# Altium schematic sheet merci_proc.SchDoc
size A4; SheetNumber: 2; SheetTotal: 2
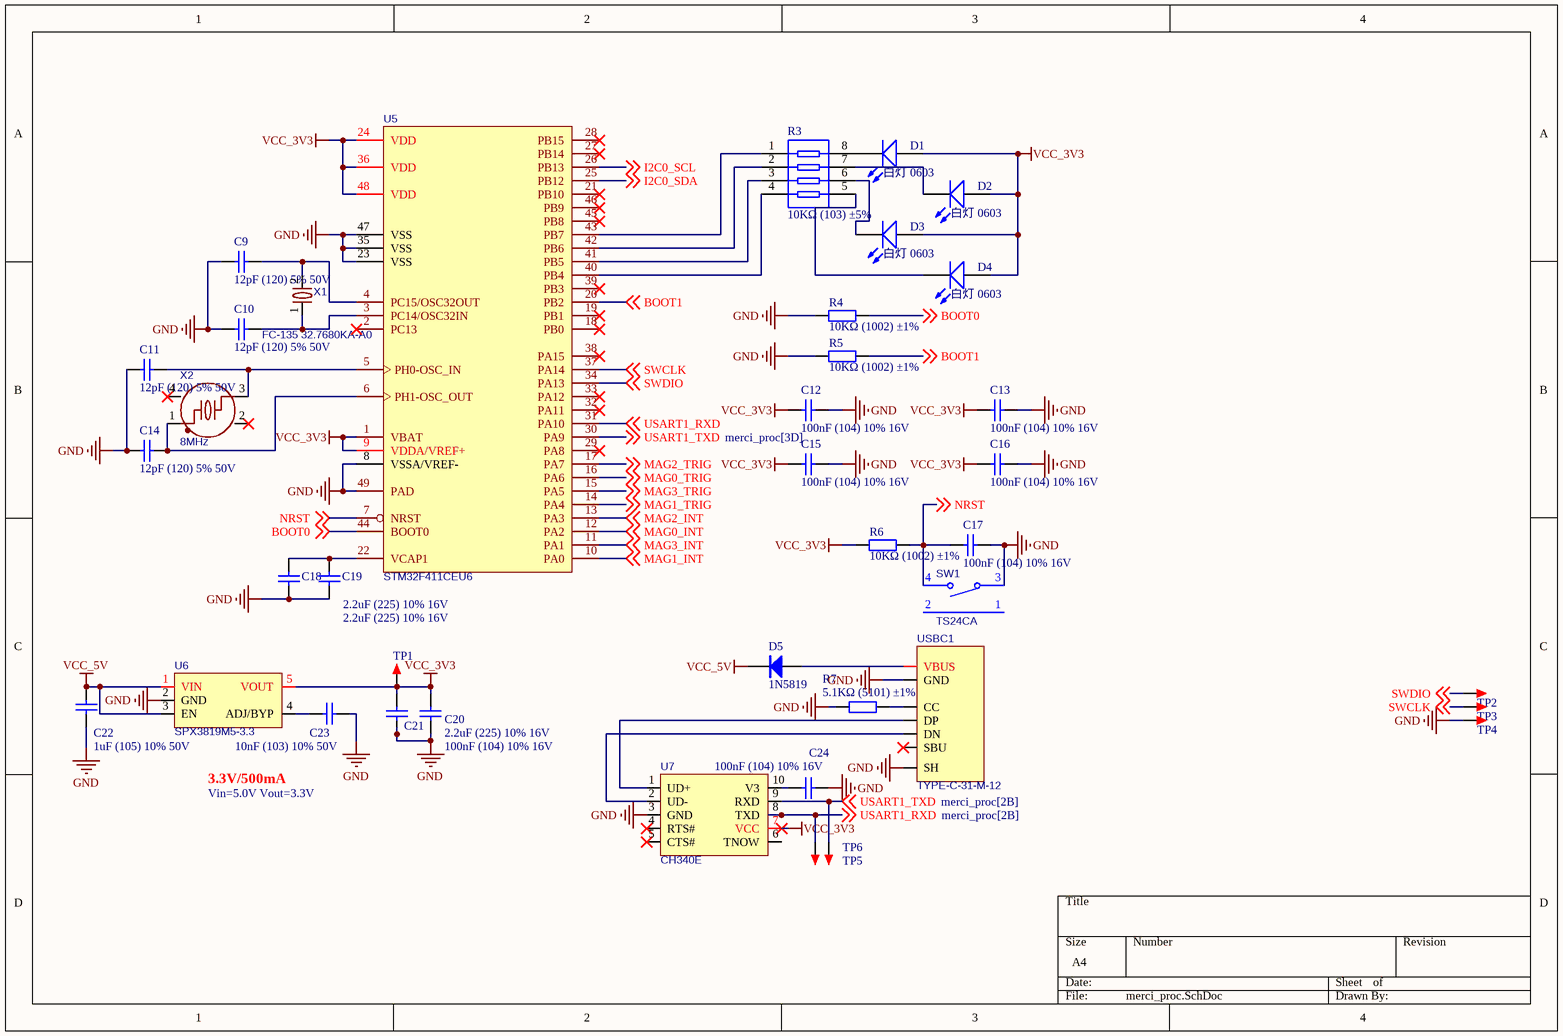
[diagram p0: merci_proc.SchDoc]

## Parts
C9  12pF (120) 5% 50V  [LC-0402_C_NOSILK]
C10  12pF (120) 5% 50V  [LC-0402_C_NOSILK]
C11  12pF (120) 5% 50V  [LC-0402_C_NOSILK]
C12  100nF (104) 10% 16V  [LC-0402_C_NOSILK]
C13  100nF (104) 10% 16V  [LC-0402_C_NOSILK]
C14  12pF (120) 5% 50V  [LC-0402_C_NOSILK]
C15  100nF (104) 10% 16V  [LC-0402_C_NOSILK]
C16  100nF (104) 10% 16V  [LC-0402_C_NOSILK]
C17  100nF (104) 10% 16V  [LC-0402_C_NOSILK]
C18  2.2uF (225) 10% 16V  [LC-0603_C_NOSILK]
C19  2.2uF (225) 10% 16V  [LC-0603_C_NOSILK]
C20  2.2uF (225) 10% 16V  [LC-0603_C_NOSILK]
C21  100nF (104) 10% 16V  [LC-0402_C_NOSILK]
C22  1uF (105) 10% 50V  [LC-0603_C_NOSILK]
C23  10nF (103) 10% 50V  [LC-0402_C_NOSILK]
C24  100nF (104) 10% 16V  [LC-0402_C_NOSILK]
D1  白灯 0603  [LC-0603_LED_S1]
D2  白灯 0603  [LC-0603_LED_S1]
D3  白灯 0603  [LC-0603_LED_S1]
D4  白灯 0603  [LC-0603_LED_S1]
D5  1N5819  [SOD-323_L1.8-W1.3-LS2.5-RD]
R3  10KΩ (103) ±5%  [LC-0402_Rx4]
R4  10KΩ (1002) ±1%  [LC-0402_R_NOSILK]
R5  10KΩ (1002) ±1%  [LC-0402_R_NOSILK]
R6  10KΩ (1002) ±1%  [LC-0402_R_NOSILK]
R7  5.1KΩ (5101) ±1%  [LC-0402_R_NOSILK]
SW1  TS24CA  [SW-SMD_TS24CA]
TP1  TEST  [TEST 1.6]  (value not drawn)
TP2  TEST  [TEST 1.6]  (value not drawn)
TP3  TEST  [TEST 1.6]  (value not drawn)
TP4  TEST  [TEST 1.6]  (value not drawn)
TP5  TEST  [TEST 1.6]  (value not drawn)
TP6  TEST  [TEST 1.6]  (value not drawn)
U5  STM32F411CEU6  [UFQFPN-48_L7.0-W7.0-P0.50-BL-EP - duplicate]
U6  SPX3819M5-3.3  [SOT-23-5_L2.9-W1.6-P0.95-LS2.8-BL]
U7  CH340E  [MSOP-10_L3.0-W3.0-P0.50-LS5.0-BL]
USBC1  TYPE-C-31-M-12  [USB-C_SMD-TYPE-C-31-M-12]
X1  FC-135 32.7680KA-A0  [CRYSTAL-SMD_L3.2-W1.5-FC-135R32.7680KF-A3]
X2  8MHz  [CRYSTAL-SMD_4P-L3.2-W2.5-BL]

## Nets
GND: C9.1 C10.1 C11.1 C12.2 C13.2 C14.1 C15.2 C16.2 C17.2 C18.1 C19.1 C20.1 C21.1 C22.1 C23.2 C24.2 R4.1 R5.1 R7.1 SW1.3 TP4.1 U5.8(VSSA/VREF-) U5.23(VSS) U5.35(VSS) U5.47(VSS) U5.49(PAD) U6.2(GND) U7.3(GND) USBC1.0,1,2,3(SH) USBC1.A1,B1,A12,B12(GND)
VCC_3V3: C12.1 C13.1 C15.1 C16.1 C20.2 C21.2 D1.A D2.A D3.A D4.A R6.1 TP1.1 U5.1(VBAT) U5.9(VDDA/VREF+) U5.24(VDD) U5.36(VDD) U5.48(VDD) U6.5(VOUT) U7.7(VCC)
VCC_5V: C22.2 D5.2(K) U6.1(VIN) U6.3(EN)
BOOT0: R4.2 U5.44(BOOT0) ; off-sheet BOOT0
BOOT1: R5.2 U5.20(PB2) ; off-sheet BOOT1
I2C0_SCL: U5.26(PB13) ; off-sheet I2C0_SCL
I2C0_SDA: U5.25(PB12) ; off-sheet I2C0_SDA
MAG0_INT: U5.12(PA2) ; off-sheet MAG0_INT
MAG0_TRIG: U5.16(PA6) ; off-sheet MAG0_TRIG
MAG1_INT: U5.10(PA0) ; off-sheet MAG1_INT
MAG1_TRIG: U5.14(PA4) ; off-sheet MAG1_TRIG
MAG2_INT: U5.13(PA3) ; off-sheet MAG2_INT
MAG2_TRIG: U5.17(PA7) ; off-sheet MAG2_TRIG
MAG3_INT: U5.11(PA1) ; off-sheet MAG3_INT
MAG3_TRIG: U5.15(PA5) ; off-sheet MAG3_TRIG
NRST: C17.1 R6.2 SW1.4 U5.7(NRST) ; off-sheet NRST
SWCLK: TP3.1 U5.37(PA14) ; off-sheet SWCLK
SWDIO: TP2.1 U5.34(PA13) ; off-sheet SWDIO
USART1_RXD: TP6.1 U5.31(PA10) U7.8(TXD) ; off-sheet USART1_RXD
USART1_TXD: TP5.1 U5.30(PA9) U7.9(RXD) ; off-sheet USART1_TXD
NetC9_2: C9.2 U5.4(PC15/OSC32OUT) X1.2(GND)
NetC10_2: C10.2 U5.3(PC14/OSC32IN) X1.1
NetC11_2: C11.2 U5.5(PH0-OSC_IN) X2.3
NetC14_2: C14.2 U5.6(PH1-OSC_OUT) X2.1
NetC18_2: C18.2 C19.2 U5.22(VCAP1)
NetC23_1: C23.1 U6.4(ADJ/BYP)
NetC24_1: C24.1 U7.10(V3)
NetD1_K: D1.K R3.8
NetD2_K: D2.K R3.7
NetD3_K: D3.K R3.6
NetD4_K: D4.K R3.5
NetD5_1: D5.1(A) USBC1.A4,A9,B4,B9(VBUS)
NetR3_1: R3.1 U5.43(PB7)
NetR3_2: R3.2 U5.42(PB6)
NetR3_3: R3.3 U5.41(PB5)
NetR3_4: R3.4 U5.40(PB4)
NetR7_2: R7.2 USBC1.A5,B5(CC)
NetU7_1: U7.1(UD+) USBC1.A6,B6(DP)
NetU7_2: U7.2(UD-) USBC1.A7,B7(DN)

Not connected (* = marked no-connect by the designer): SW1 1 2; U5 2(PC13)* 18(PB0)* 19(PB1)* 21(PB10)* 27(PB14)* 28(PB15)* 29(PA8)* 32(PA11)* 33(PA12)* 38(PA15)* 39(PB3)* 45(PB8)* 46(PB9)*; U7 4(RTS#)* 5(CTS#)* 6(TNOW); USBC1 A8,B8(SBU)*; X2 2(GND)* 4(GND)*

## Notes on the sheet
- 3.3V/500mA
- Vin=5.0V Vout=3.3V

## Library data of the parts
C9-C11 C14 = 0402 12pF (120) 5% 50V: 贴片电容; ComponentLink1Description: 供应商链接; ComponentLink1URL: http://www.szlcsc.com/product/details_1899.html; Package: 0402; Supplier: LC; SuppliersPartNumber: C1547
C12 C13 C15-C17 C21 C24 = 0402 100nF (104) 10% 16V: 贴片电容; ComponentLink1Description: 供应商链接; ComponentLink1URL: http://www.szlcsc.com/product/details_1877.html; Package: 0402; Supplier: LC; SuppliersPartNumber: C1525
C18-C20 = 0603 2.2uF (225) 10% 16V: 贴片电容; ComponentLink1Description: 供应商链接; ComponentLink1URL: http://www.szlcsc.com/product/details_24366.html; Package: 0603; Supplier: LC; SuppliersPartNumber: C23630
C22 = 0603 1uF (105) 10% 50V: 贴片电容; ComponentLink1Description: 供应商链接; ComponentLink1URL: http://www.szlcsc.com/product/details_16531.html; Package: 0603; Supplier: LC; SuppliersPartNumber: C15849
C23 = 0402 10nF (103) 10% 50V: 贴片电容; ComponentLink1Description: 供应商链接; ComponentLink1URL: http://www.szlcsc.com/product/details_15869.html; Package: 0402; Supplier: LC; SuppliersPartNumber: C15195
D1-D4 = 0603 白灯: 发光二极管; ComponentLink1Description: 供应商链接; ComponentLink1URL: http://www.szlcsc.com/product/details_2663.html; Package: 0603; Supplier: LC; SuppliersPartNumber: C2290
D5 = 1N5819: 肖特基二极管; 版权归属: 源创客; 属性: 40V/2A; BOM名称: 肖特基二极管; 学习资源: www.ooocke.com
R3 = 0402*4 10KΩ (103) 5%: 贴片排阻; ComponentLink1Description: 供应商链接; ComponentLink1URL: http://www.szlcsc.com/product/details_26468.html; Package: 0402*4; Supplier: LC; SuppliersPartNumber: C25725
R4-R6 = 0402 10KΩ (1002) 1%: 贴片电阻; ComponentLink1Description: 供应商链接; ComponentLink1URL: http://www.szlcsc.com/product/details_26487.html; Package: 0402; Supplier: LC; SuppliersPartNumber: C25744
R7 = 0402 5.1KΩ (5101) 1%: 贴片电阻; ComponentLink1Description: 供应商链接; ComponentLink1URL: http://www.szlcsc.com/product/details_26648.html; Package: 0402; Supplier: LC; SuppliersPartNumber: C25905
SW1 = TS24CA: 按键; BOM_Manufacturer: SHOU HAN(首韩); Contributor: LCSC; BOM_Supplier: LCSC; BOM_Supplier Part: C393942; BOM_Manufacturer Part: TS24CA; BOM_JLCPCB Part Class: Extended Part; spicePre: S; spiceSymbolName: TS24CA
TP1-TP6 = TEST: 测试点; 版权归属: 源创客; BOM名称: 测试点; 学习资源: www.ooocke.com
U5 = STM32F411CEU6: BOM_Manufacturer: ST(意法半导体); BOM_Supplier: LCSC; BOM_Manufacturer Part: STM32F411CEU6; BOM_Supplier Part: C60420; BOM_JLCPCB Part Class: Extended Part; spicePre: U; spiceSymbolName: STM32F411CEU6
U6 = SPX3819M5-3.3: Vin=16V Vout=3.3V 500mA LDO; BOM_Manufacturer: null; Contributor: lcsc; BOM_Supplier: LCSC; BOM_Supplier Part: C9900018941; BOM_Manufacturer Part: SPX3819M5-3.3; BOM_JLCPCB Part Class: Extended Part; spicePre: U; spiceSymbolName: SPX3819M5-3.3
U7 = CH340E: ttl-usb芯片; BOM_Manufacturer: WCH(南京沁恒); BOM_Supplier: LCSC; BOM_Manufacturer Part: CH340E; BOM_Supplier Part: C99652; BOM_JLCPCB Part Class: Extended Part; spicePre: U; spiceSymbolName: CH340E
USBC1 = TYPE-C-31-M-12: 贴片type-c母座; BOM_Manufacturer: 韩国韩荣; Contributor: LCSC; BOM_Supplier: LCSC; BOM_Supplier Part: C165948; BOM_Manufacturer Part: TYPE-C-31-M-12; BOM_JLCPCB Part Class: Extended Part; spicePre: U; spiceSymbolName: TYPE-C-31-M-12
X1 = FC-135 32.7680KA-A0: BOM_Manufacturer: EPSON(爱普生); Contributor: lcsc; BOM_Supplier: LCSC; BOM_Supplier Part: C2650444; BOM_Manufacturer Part: FC-135 32.7680KA-A0; link: https://atta.szlcsc.com/upload/public/pdf/source/20211127/C2650444_3DEB46927A758E75F8CF3F6FA0A6BD9B.pdf; spicePre: X; spiceSymbolName: FC-135 32.7680KA-A0
X2 = 8MHz: BOM_Manufacturer: JWT(晶威特); BOM_Manufacturer Part: CF4008M00012T8188031; Contributor: LCSC; nameAlias: Frequency; BOM_Supplier: LCSC; BOM_Supplier Part: C2933033; spicePre: X; spiceSymbolName: CF4008M00012T8188031